# Altium schematic sheet LED_Indicator.SchDoc
size A; SheetNumber: 5; SheetTotal: 6
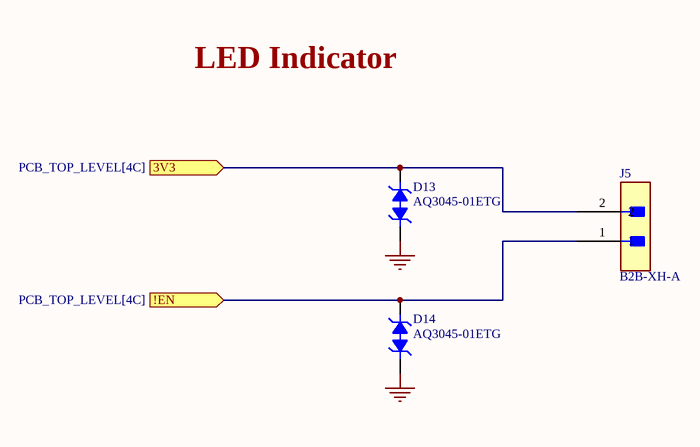
[diagram p0: LED_Indicator.SchDoc]

## Parts
D13  AQ3045-01ETG  [SOD882]
D14  AQ3045-01ETG  [SOD882]
J5  B2B-XH-A  [CONN_B2B-XH-A_JST]

## Ports
3V3 (in, see PCB_TOP_LEVEL[4C]), !EN (in, see PCB_TOP_LEVEL[4C])

## Nets
GND: D13.1 D14.1
3V3: D13.2 J5.2 ; port 3V3
!EN: D14.2 J5.1 ; port !EN

## Notes on the sheet
- LED Indicator

## Library data of the parts
D13 D14 = AQ3045-01ETG: TVS DIODE 5.3VWM 12VC SOD882; Manufacturer: Littelfuse; Diode Element Material: SILICON; Package Body Material: Plastic; Polarity: Bidirectional; Max Breakdown Voltage: 9V; Min Breakdown Voltage: 6.8V; Diode Type: TRANS VOLTAGE SUPPRESSOR; Non-rep Peak Rev Power Dis-Max: 40W; Number of Elements: 1; Rep Pk Reverse Voltage-Max: 5.3V; Reference Standard: AEC-Q101; Supplier: Digikey; Supplier Part Number: F9321CT-ND; Manufacturer Part Number: AQ3045-01ETG; RoHS: Yes; Category: TVS Diodes; Stock: 21664; Pricing: 1=0.5, 10=0.391, 100=0.2344, 500=0.217, 1000=0.14756, 2000=0.13585, 5000=0.1302 (USD); Pins: 2; Package Shape: Rectangular; Min Operating Temperature: -55°C; Max Operating Temperature: 150°C; Package Style: CHIP CARRIERMeter; Surface Mount: Yes; Technology: AVALANCHE; Terminal Form: No Lead; Terminal Position: BOTTOM; Reach SVHC Compliant: Yes; RoHS Compliant: Yes; ComponentLink1URL: https://datasheet.ciiva.com:443/pdfs/VipMasterIC/IC/LFSI/LFSI-S-A0007892042/LFSI-S-A0007892042-1.pdf?src-supplier=IHS+Markit; ComponentLink1Description: https://datasheet.ciiva.com:443/pdfs/VipMasterIC/IC/LFSI/LFSI-S-A0007892042/LFSI-S-A0007892042-1.pdf?src-supplier=IHS+Markit; ComponentLink2URL: https://www.littelfuse.com/~/media/electronics/datasheets/tvs_diode_arrays/littelfuse_tvs_diode_array_aq3045_datasheet.pdf.pdf?src-supplier=Digikey; ComponentLink2Description: https://www.littelfuse.com/~/media/electronics/datasheets/tvs_diode_arrays/littelfuse_tvs_diode_array_aq3045_datasheet.pdf.pdf?src-supplier=Digikey; ComponentLink3URL: http://www.littelfuse.com/~/media/electronics/datasheets/tvs_diode_arrays/littelfuse_tvs_diode_array_aq3045_datasheet.pdf.pdf?src-supplier=Digikey; ComponentLink3Description: http://www.littelfuse.com/~/media/electronics/datasheets/tvs_diode_arrays/littelfuse_tvs_diode_array_aq3045_datasheet.pdf.pdf?src-supplier=Digikey; LCSC Part Number: C3710326
J5 = B2B-XH-A: Board Connector, 2 Contact(s), 1 Row(s), Male, Straight, Solder Terminal; Manufacturer: JST; Contact Resistance: 20mΩ; Current Rating: 3A; Insulation Resistance: 1GΩ; Supplier: DigiKey; Supplier Part Number: 455-B2B-XH-A-ND; Manufacturer Part Number: B2B-XH-A; RoHS: Compliant; Category: Card Edge Connectors; Stock: 111560; Pricing: 1=0.1, 10=0.073, 100=0.0618, 500=0.05514, 1000=0.05251, 5000=0.04686, 10000=0.04463 (USD); Contact Gender: Male; Contact Material: Brass; Housing Material: Nylon; Lifecycle Status: Production; Max Operating Temperature: 85°C; Min Operating Temperature: -25°C; Pins: 2; Number of Rows: 1; Orientation: Straight; Terminal Pitch: 2.5mm; ComponentLink1URL: https://datasheet.octopart.com:443/B2B-XH-A-JST-datasheet-157850277.pdf?src-supplier=IHS; ComponentLink1Description: https://datasheet.octopart.com:443/B2B-XH-A-JST-datasheet-157850277.pdf?src-supplier=IHS; ComponentLink2URL: https://datasheet.octopart.com:443/B2B-XH-A-JST-datasheet-10026044.pdf?src-supplier=TME; ComponentLink2Description: https://datasheet.octopart.com:443/B2B-XH-A-JST-datasheet-10026044.pdf?src-supplier=TME